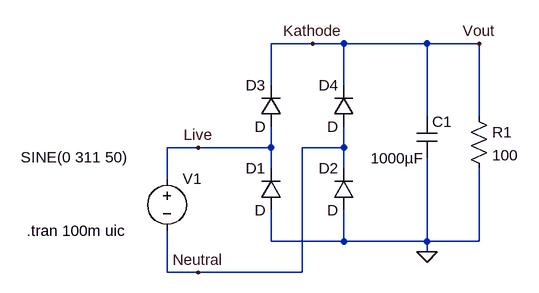
[diagram p0: schematic UncontrolledRectifierResistiveLoad.asc]
UncontrolledRectifierResistiveLoad.asc, the LTspice schematic file:
Version 4
SHEET 1 880 680
WIRE 288 -80 224 -80
WIRE 336 -80 288 -80
WIRE 464 -80 336 -80
WIRE 544 -80 464 -80
WIRE 224 -16 224 -80
WIRE 336 -16 336 -80
WIRE 464 32 464 -80
WIRE 544 32 544 -80
WIRE 112 80 64 80
WIRE 224 80 224 48
WIRE 224 80 112 80
WIRE 336 80 336 48
WIRE 336 80 272 80
WIRE 224 112 224 80
WIRE 336 112 336 80
WIRE 64 128 64 80
WIRE 224 224 224 176
WIRE 336 224 336 176
WIRE 336 224 224 224
WIRE 464 224 464 96
WIRE 464 224 336 224
WIRE 544 224 544 112
WIRE 544 224 464 224
WIRE 464 240 464 224
WIRE 64 272 64 208
WIRE 112 272 64 272
WIRE 272 272 272 80
WIRE 272 272 112 272
FLAG 464 240 0
FLAG 288 -80 Kathode
FLAG 112 80 Live
FLAG 112 272 Neutral
FLAG 544 -80 Vout
SYMBOL diode 240 176 R180
WINDOW 0 24 64 Left 2
WINDOW 3 24 0 Left 2
SYMATTR InstName D1
SYMBOL diode 352 176 R180
WINDOW 0 24 64 Left 2
WINDOW 3 24 0 Left 2
SYMATTR InstName D2
SYMBOL voltage 64 112 R0
WINDOW 3 -225 -17 Left 2
WINDOW 123 0 0 Left 2
WINDOW 39 0 0 Left 2
SYMATTR Value SINE(0 311 50)
SYMATTR InstName V1
SYMBOL res 528 16 R0
SYMATTR InstName R1
SYMATTR Value 100
SYMBOL diode 240 48 R180
WINDOW 0 24 64 Left 2
WINDOW 3 24 0 Left 2
SYMATTR InstName D3
SYMBOL diode 352 48 R180
WINDOW 0 24 64 Left 2
WINDOW 3 24 0 Left 2
SYMATTR InstName D4
SYMBOL cap 448 32 R0
WINDOW 3 -71 64 Left 2
SYMATTR Value 1000µF
SYMATTR InstName C1
TEXT -152 208 Left 2 !.tran 100m uic

The netlist it stands for:
* UncontrolledRectifierResistiveLoad.asc
D1 0 Live D
D2 0 Neutral D
V1 Live Neutral SINE(0 311 50)
R1 Vout 0 100
D3 Live Vout D
D4 Neutral Vout D
C1 Vout 0 1000µF
.model D D
.lib standard.dio
.tran 100m uic
.backanno
.end

* Results of the author's LTspice run, read from the files saved beside the schematic
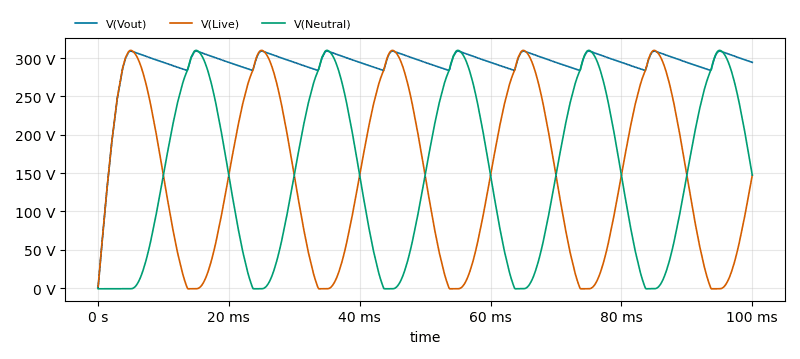
[diagram p1: Transient Analysis of UncontrolledRectifierResistiveLoad.asc, plotted from the saved traces]
* Transient Analysis, 1 run:
*   V(Vout): min 0 V, max 309.2 V, average 292.1 V, rms 293.9 V, last 294.4 V
*   V(Live): min -930.7 mV, max 310.1 V, average 146.1 V, rms 183.1 V, last 147.2 V
*   V(Neutral): min -952.3 mV, max 310.1 V, average 146.1 V, rms 184.4 V, last 147.2 V